# Altium schematic sheet InputsExtras.SchDoc
size A4
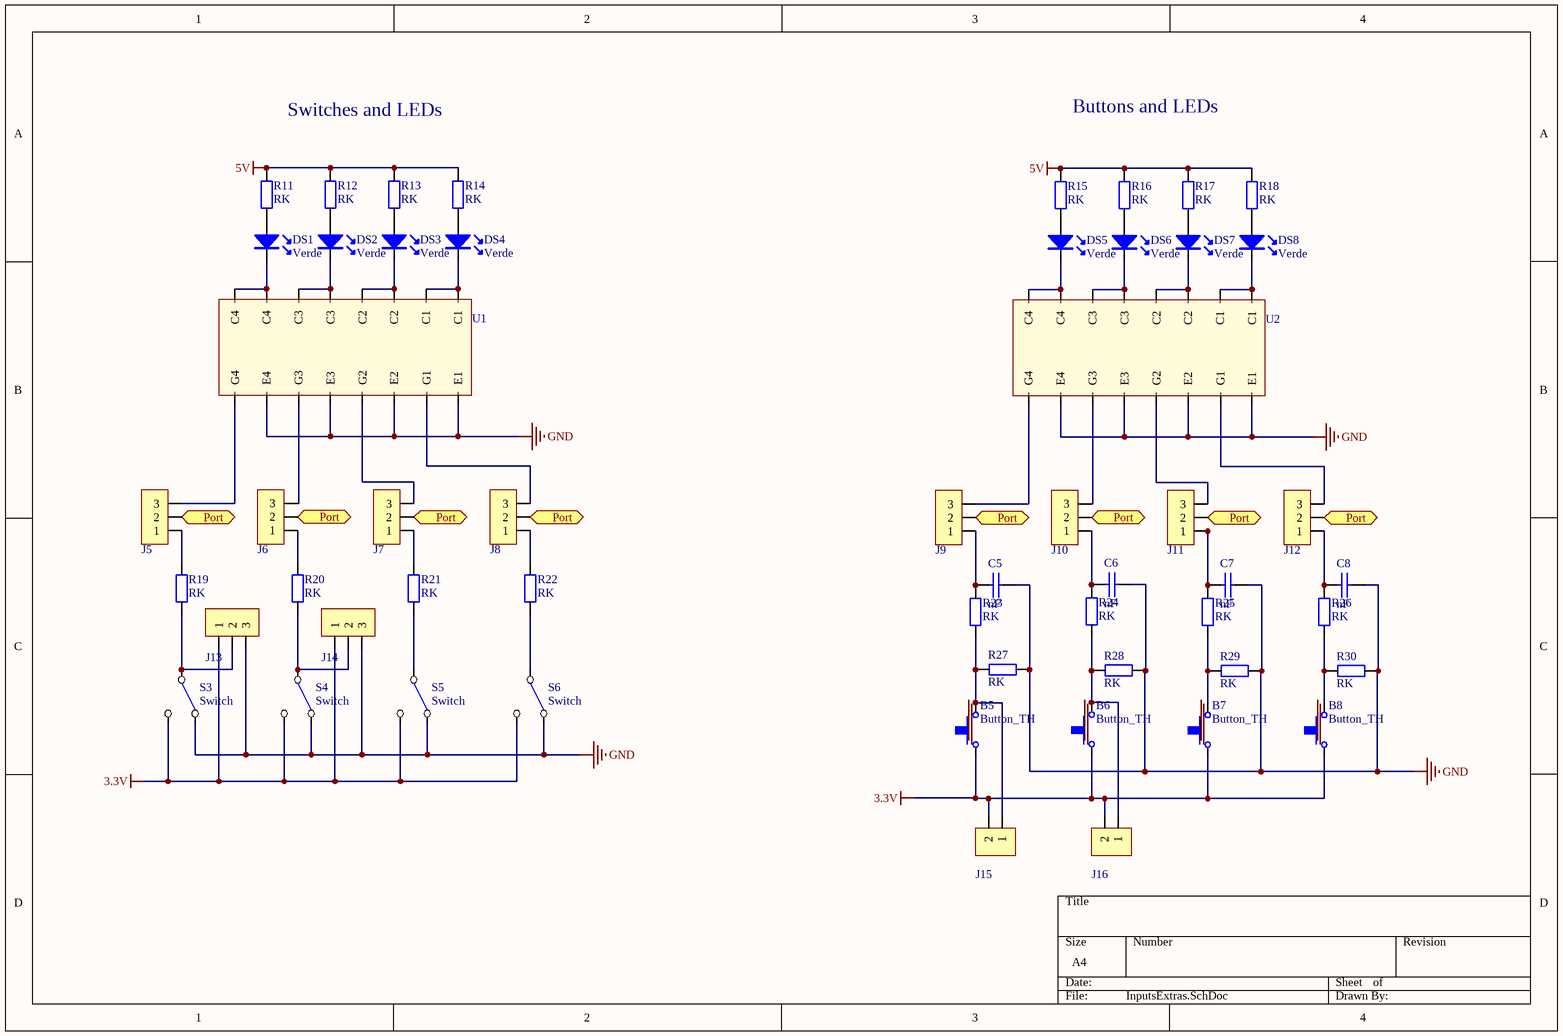
[diagram p0: InputsExtras.SchDoc]

## Parts
B5  Button_TH  [ButtonTH]
B6  Button_TH  [ButtonTH]
B7  Button_TH  [ButtonTH]
B8  Button_TH  [ButtonTH]
C5  nF  [1206]
C6  nF  [1206]
C7  nF  [1206]
C8  nF  [1206]
DS1  Verde  [Led 3mm]
DS2  Verde  [Led 3mm]
DS3  Verde  [Led 3mm]
DS4  Verde  [Led 3mm]
DS5  Verde  [Led 3mm]
DS6  Verde  [Led 3mm]
DS7  Verde  [Led 3mm]
DS8  Verde  [Led 3mm]
J5  Cleva 2 vias  [con_3_100milis]  (value not drawn)
J6  Cleva 2 vias  [con_3_100milis]  (value not drawn)
J7  Cleva 2 vias  [con_3_100milis]  (value not drawn)
J8  Cleva 2 vias  [con_3_100milis]  (value not drawn)
J9  Cleva 2 vias  [con_3_100milis]  (value not drawn)
J10  Cleva 2 vias  [con_3_100milis]  (value not drawn)
J11  Cleva 2 vias  [con_3_100milis]  (value not drawn)
J12  Cleva 2 vias  [con_3_100milis]  (value not drawn)
J13  Cleva 2 vias  [Con3_KK_256]  (value not drawn)
J14  Cleva 2 vias  [Con3_KK_256]  (value not drawn)
J15  Cleva 2 vias  [Con2_KK_256]  (value not drawn)
J16  Cleva 2 vias  [Con2_KK_256]  (value not drawn)
R11  RK  [1206]
R12  RK  [1206]
R13  RK  [1206]
R14  RK  [1206]
R15  RK  [1206]
R16  RK  [1206]
R17  RK  [1206]
R18  RK  [1206]
R19  RK  [1206]
R20  RK  [1206]
R21  RK  [1206]
R22  RK  [1206]
R23  RK  [1206]
R24  RK  [1206]
R25  RK  [1206]
R26  RK  [1206]
R27  RK  [1206]
R28  RK  [1206]
R29  RK  [1206]
R30  RK  [1206]
S3  Switch  [SwitchTH_2Pos]
S4  Switch  [SwitchTH_2Pos]
S5  Switch  [SwitchTH_2Pos]
S6  Switch  [SwitchTH_2Pos]
U1  MMPQ3904  [SO-16]  (value not drawn)
U2  MMPQ3904  [SO-16]  (value not drawn)

## Ports
Port

## Nets
3.3V: B5.1 B6.1 B7.1 B8.1 J13.1 J14.1 J15.2 J16.2 S3.2(ON2) S4.2(ON2) S5.2(ON2) S6.2(ON2)
5V: R11.1 R12.1 R13.1 R14.1 R15.1 R16.1 R17.1 R18.1
GND: C5.1 C6.1 C7.1 C8.1 J13.3 J14.3 R27.1 R28.1 R29.1 R30.1 S3.0(ON1) S4.0(ON1) S5.0(ON1) S6.0(ON1) U1.10(E4) U1.12(E3) U1.14(E2) U1.16(E1) U2.10(E4) U2.12(E3) U2.14(E2) U2.16(E1)
Port: J5.2 J6.2 J7.2 J8.2 J9.2 J10.2 J11.2 J12.2 ; port Port
NetB5_0: B5.0 J15.1 R23.1 R27.2
NetB6_0: B6.0 J16.1 R24.1 R28.2
NetB7_0: B7.0 R25.1 R29.2
NetB8_0: B8.0 R26.1 R30.2
NetC5_2: C5.2 J9.1 R23.2
NetC6_2: C6.2 J10.1 R24.2
NetC7_2: C7.2 J11.1 R25.2
NetC8_2: C8.2 J12.1 R26.2
NetDS1_A: DS1.A R11.2
NetDS1_K: DS1.K U1.7(C4) U1.8(C4)
NetDS2_A: DS2.A R12.2
NetDS2_K: DS2.K U1.5(C3) U1.6(C3)
NetDS3_A: DS3.A R13.2
NetDS3_K: DS3.K U1.3(C2) U1.4(C2)
NetDS4_A: DS4.A R14.2
NetDS4_K: DS4.K U1.1(C1) U1.2(C1)
NetDS5_A: DS5.A R15.2
NetDS5_K: DS5.K U2.7(C4) U2.8(C4)
NetDS6_A: DS6.A R16.2
NetDS6_K: DS6.K U2.5(C3) U2.6(C3)
NetDS7_A: DS7.A R17.2
NetDS7_K: DS7.K U2.3(C2) U2.4(C2)
NetDS8_A: DS8.A R18.2
NetDS8_K: DS8.K U2.1(C1) U2.2(C1)
NetJ5_1: J5.1 R19.2
NetJ5_3: J5.3 U1.9(G4)
NetJ6_1: J6.1 R20.2
NetJ6_3: J6.3 U1.11(G3)
NetJ7_1: J7.1 R21.2
NetJ7_3: J7.3 U1.13(G2)
NetJ8_1: J8.1 R22.2
NetJ8_3: J8.3 U1.15(G1)
NetJ9_3: J9.3 U2.9(G4)
NetJ10_3: J10.3 U2.11(G3)
NetJ11_3: J11.3 U2.13(G2)
NetJ12_3: J12.3 U2.15(G1)
NetJ13_2: J13.2 R19.1 S3.1(COMMON)
NetJ14_2: J14.2 R20.1 S4.1(COMMON)
NetR21_1: R21.1 S5.1(COMMON)
NetR22_1: R22.1 S6.1(COMMON)

## Notes on the sheet
- Buttons and LEDs
- Switches and LEDs

## Library data of the parts
C5-C8 = Condensador
DS1-DS8 = Led
J5-J14 = Con_3
J15 J16 = Con_2
R11-R30 = Resistencia: Potencia: 1/4W